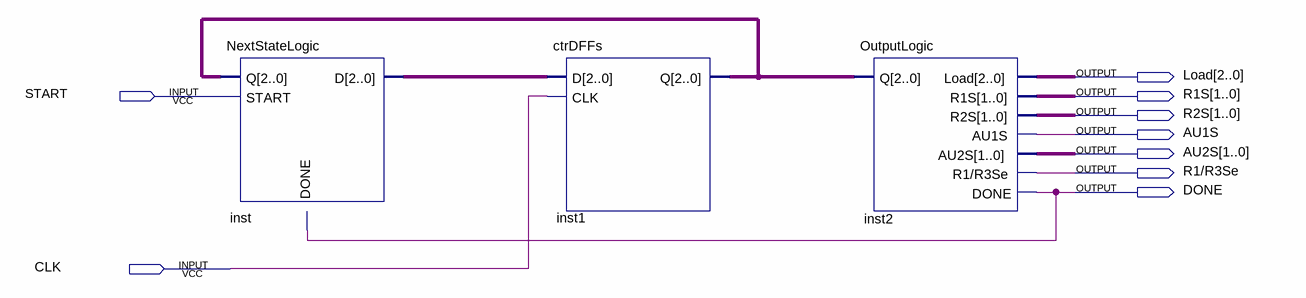
[diagram p0: schematic sheet]
// Quartus schematic ControllerOM.bdf as structural Verilog: 3 symbols, 9 pins
module ControllerOM (
  input  START,
  input  CLK,
  output [2:0] Load,
  output [1:0] R1S,
  output [1:0] R2S,
  output AU1S,
  output [1:0] AU2S,
  output \R1/R3Se ,
  output DONE
);

  wire [2:0] inst1_q, inst_d;

  NextStateLogic inst (.Q(inst1_q), .START(START), .DONE(DONE), .D(inst_d));
  ctrDFFs inst1 (.D(inst_d), .CLK(CLK), .Q(inst1_q));
  OutputLogic inst2 (
    .Q(inst1_q), .Load(Load), .R1S(R1S), .R2S(R2S), .AU1S(AU1S), .AU2S(AU2S), .\R1/R3Se (\R1/R3Se ),
    .DONE(DONE));
endmodule
